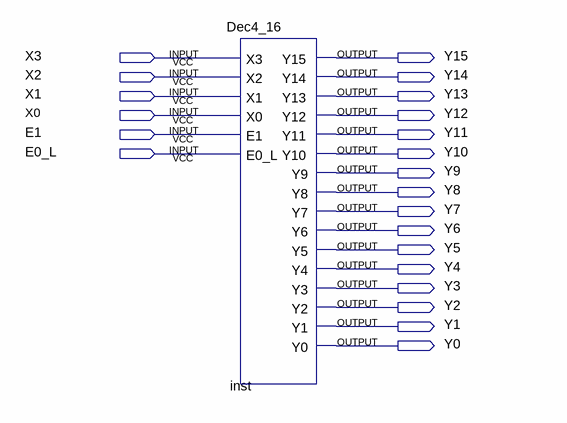
[diagram p0: schematic sheet]
// Quartus schematic DecDemo2.bdf as structural Verilog: 1 symbols, 22 pins
module DecDemo2 (
  input  X3,
  input  X2,
  input  X1,
  input  X0,
  input  E1,
  input  E0_L,
  output Y15,
  output Y14,
  output Y13,
  output Y12,
  output Y11,
  output Y10,
  output Y9,
  output Y8,
  output Y7,
  output Y6,
  output Y5,
  output Y4,
  output Y3,
  output Y2,
  output Y1,
  output Y0
);

  Dec4_16 inst (
    .X3(X3), .X2(X2), .X1(X1), .X0(X0), .E1(E1), .E0_L(E0_L), .Y15(Y15), .Y14(Y14), .Y13(Y13), .Y12(Y12),
    .Y11(Y11), .Y10(Y10), .Y9(Y9), .Y8(Y8), .Y7(Y7), .Y6(Y6), .Y5(Y5), .Y4(Y4), .Y3(Y3), .Y2(Y2), .Y1(Y1),
    .Y0(Y0));
endmodule
